# EAGLE design AFM_QFM_Piezo_controller (EAGLE 9.6.2)
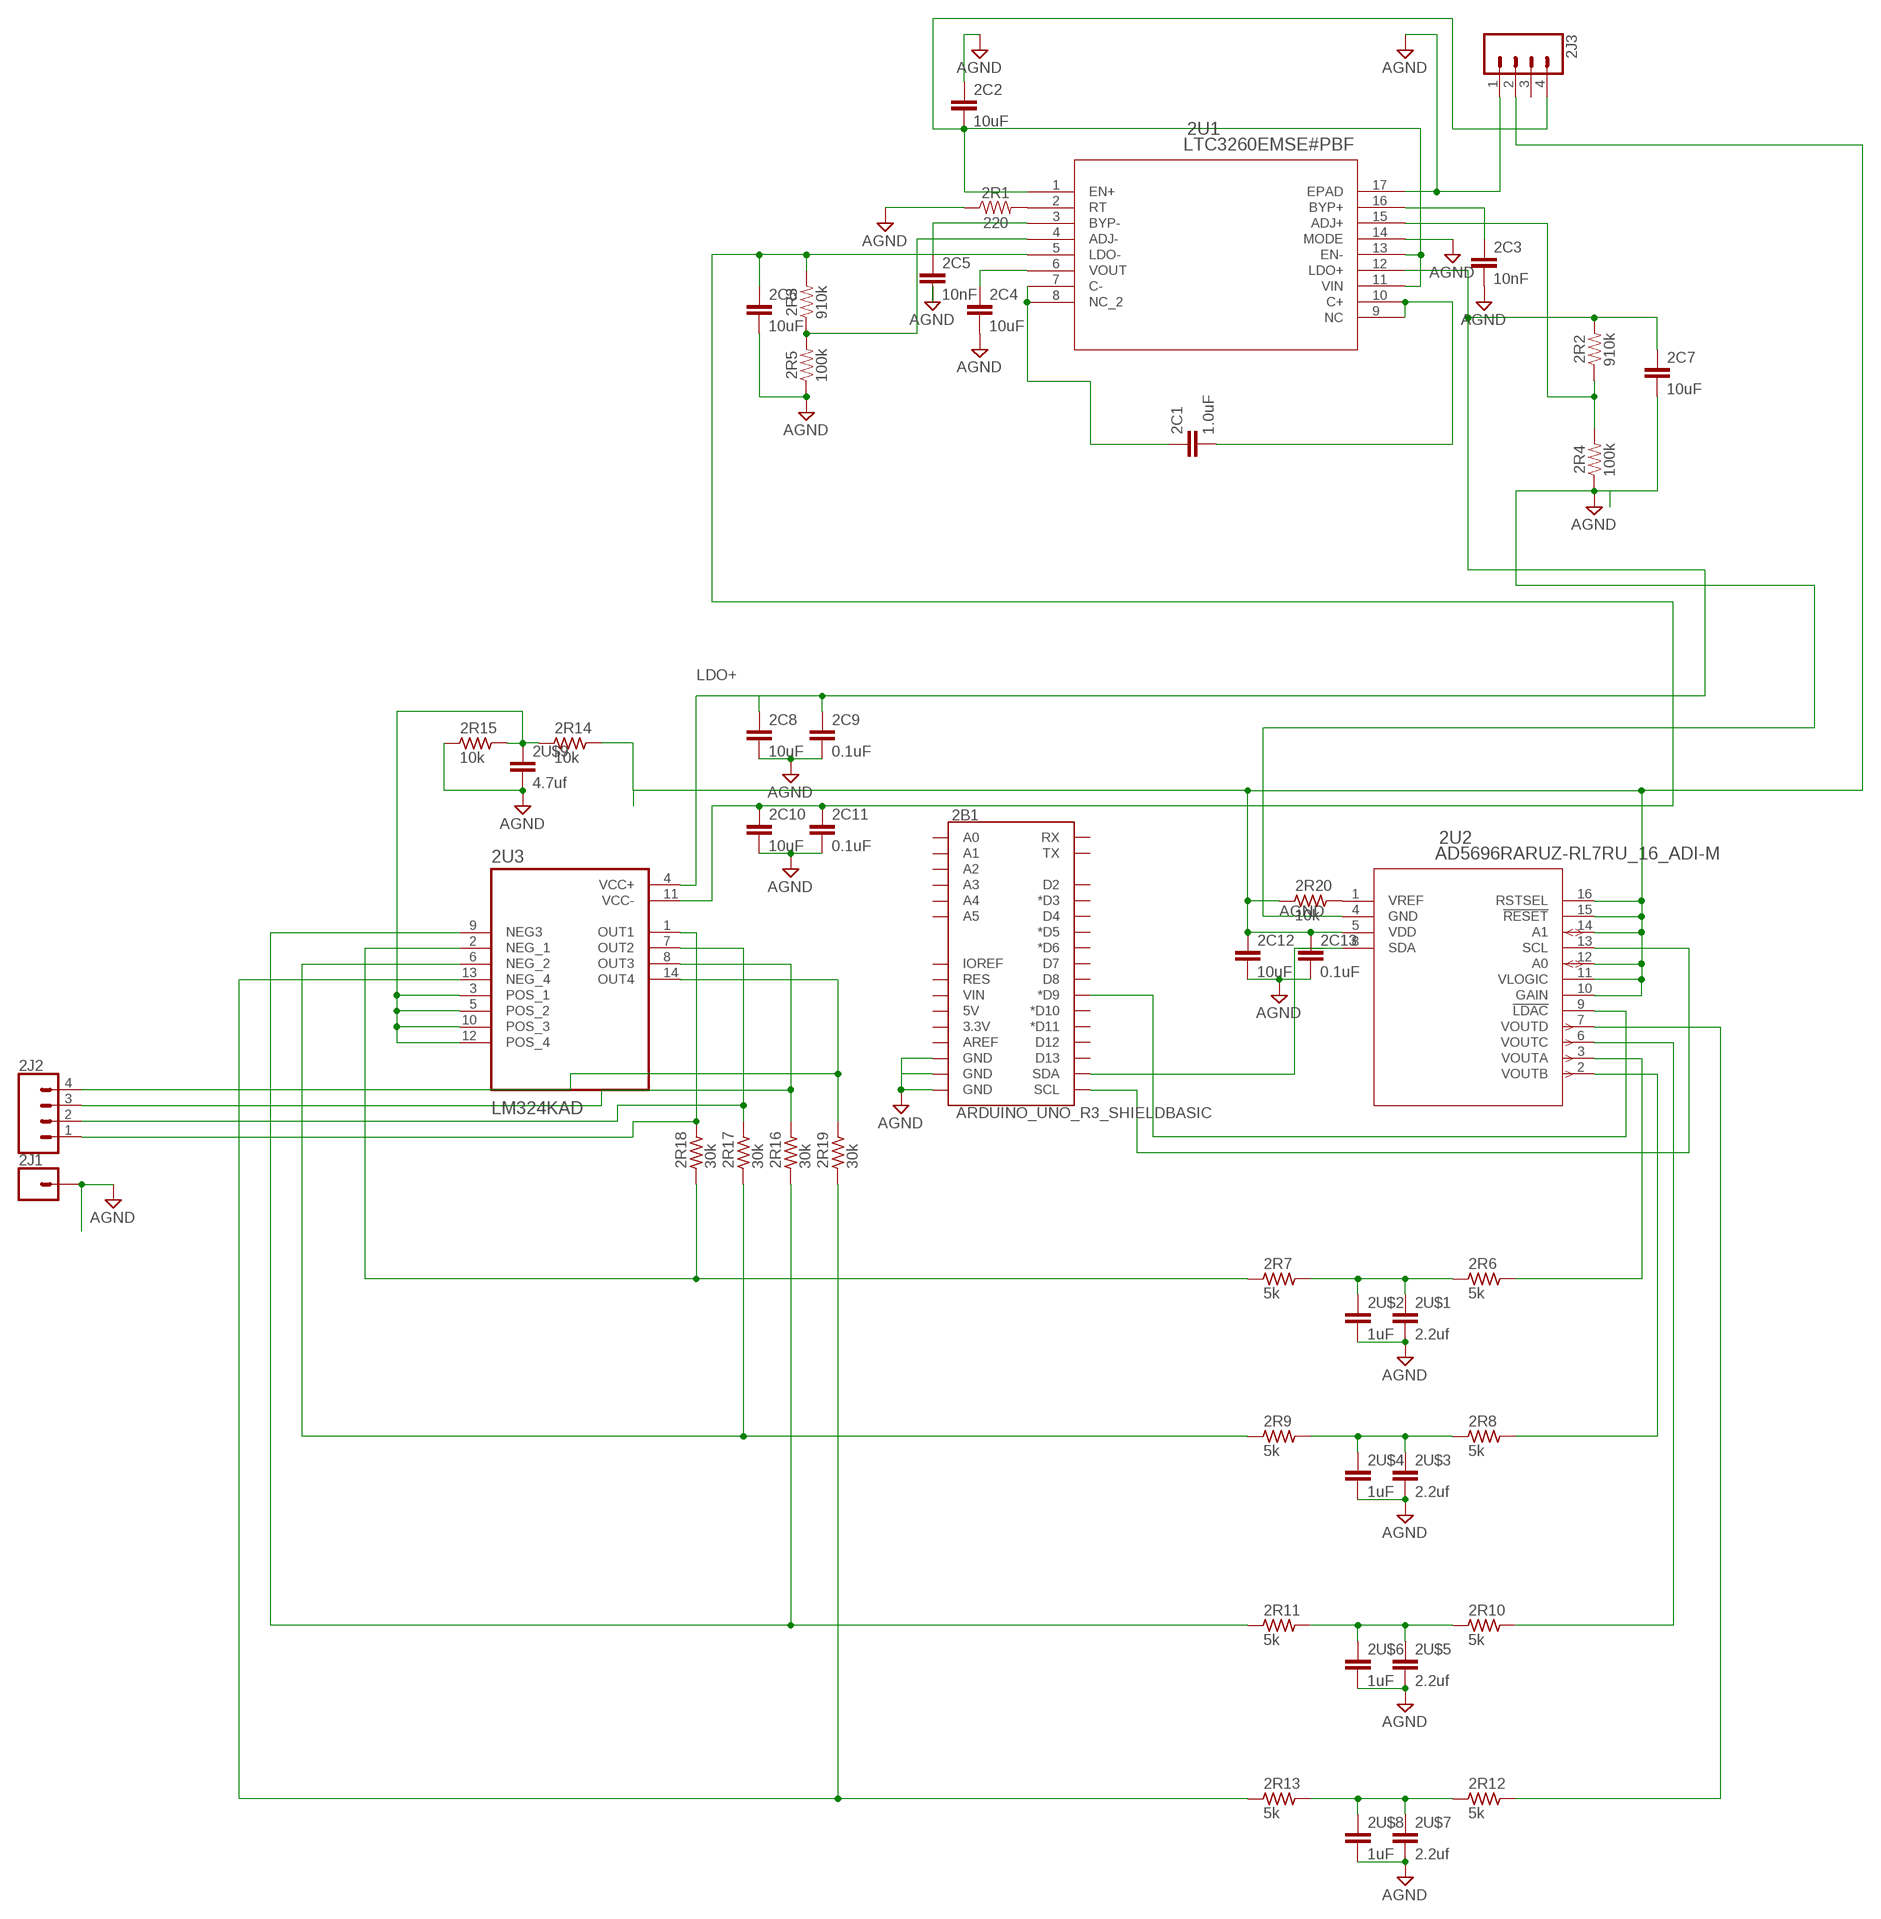
[diagram p0: schematic, sheet 1]

## Parts
2B1  ARDUINO_UNO_R3_SHIELDBASIC  [UNO_R3_SHIELD]
2C1  1.0uF  1.0UF-0805-25V-(+80/-20%)  [0805]
2C2  10uF  10UF-0805-25V-10%  [0805]
2C3  10nF  10NF-0603-50V-10%  [0603]
2C4  10uF  10UF-0805-25V-10%  [0805]
2C5  10nF  10NF-0603-50V-10%  [0603]
2C6  10uF  10UF-0805-25V-10%  [0805]
2C7  10uF  10UF-0805-25V-10%  [0805]
2C8  10uF  10UF-0805-10V-10%  [0805]
2C9  0.1uF  C  [C0805]
2C10  10uF  10UF-0805-10V-10%  [0805]
2C11  0.1uF  C  [C0805]
2C12  10uF  10UF-0805-10V-10%  [0805]
2C13  0.1uF  C  [C0805]
2J1  CONN_01PTH_LONGPAD  [1X01_LONGPAD]
2J2  CONN_04LONGPADS  [1X04_LONGPADS]
2J3  CONN_04LONGPADS  [1X04_LONGPADS]
2R1  220  220OHM-0603-1/10W-1%  [0603]
2R2  910k  100KOHM-0603-1/10W-1%  [0603]
2R3  910k  100KOHM-0603-1/10W-1%  [0603]
2R4  100k  300KOHM-0603-1/10W-1%  [0603]
2R5  100k  300KOHM-0603-1/10W-1%  [0603]
2R6  5k  RC-MASTER-SMD_R_0603MP  [RC-MASTER-SMD_R0603MP]
2R7  5k  RC-MASTER-SMD_R_0603MP  [RC-MASTER-SMD_R0603MP]
2R8  5k  RC-MASTER-SMD_R_0603MP  [RC-MASTER-SMD_R0603MP]
2R9  5k  RC-MASTER-SMD_R_0603MP  [RC-MASTER-SMD_R0603MP]
2R10  5k  RC-MASTER-SMD_R_0603MP  [RC-MASTER-SMD_R0603MP]
2R11  5k  RC-MASTER-SMD_R_0603MP  [RC-MASTER-SMD_R0603MP]
2R12  5k  RC-MASTER-SMD_R_0603MP  [RC-MASTER-SMD_R0603MP]
2R13  5k  RC-MASTER-SMD_R_0603MP  [RC-MASTER-SMD_R0603MP]
2R14  10k  RC-MASTER-SMD_R_0603MP  [RC-MASTER-SMD_R0603MP]
2R15  10k  RC-MASTER-SMD_R_0603MP  [RC-MASTER-SMD_R0603MP]
2R16  30k  RC-MASTER-SMD_R_0603MP  [RC-MASTER-SMD_R0603MP]
2R17  30k  RC-MASTER-SMD_R_0603MP  [RC-MASTER-SMD_R0603MP]
2R18  30k  RC-MASTER-SMD_R_0603MP  [RC-MASTER-SMD_R0603MP]
2R19  30k  RC-MASTER-SMD_R_0603MP  [RC-MASTER-SMD_R0603MP]
2R20  10k  RC-MASTER-SMD_R_0603MP  [RC-MASTER-SMD_R0603MP]
2U1  LTC3260EMSE#PBF  [MSOP-16_MSE]
2U2  AD5696RARUZ-RL7RU_16_ADI-M  [RU_16_ADI-M]
2U3  LM324KAD  [SOIC127P600X175-14N]
2U$1  2.2uf  CAPACITOR_0603_M  [RESC0603_M]
2U$2  1uF  CAPACITOR_0603_M  [RESC0603_M]
2U$3  2.2uf  CAPACITOR_0603_M  [RESC0603_M]
2U$4  1uF  CAPACITOR_0603_M  [RESC0603_M]
2U$5  2.2uf  CAPACITOR_0603_M  [RESC0603_M]
2U$6  1uF  CAPACITOR_0603_M  [RESC0603_M]
2U$7  2.2uf  CAPACITOR_0603_M  [RESC0603_M]
2U$8  1uF  CAPACITOR_0603_M  [RESC0603_M]
2U$9  4.7uf  CAPACITOR_0603_M  [RESC0603_M]

## Nets
AGND: 2B1.GND@0(GND) 2B1.GND@1(GND) 2B1.GND@2(GND) 2C2.1 2C3.2 2C4.2 2C5.2 2C6.2 2C7.2 2C8.2 2C9.2 2C10.2 2C11.2 2C12.2 2C13.2 2J1.1 2J3.1 2R1.1 2R4.1 2R5.1 2R15.1 2U1.14(MODE) 2U1.17(EPAD) 2U2.4(GND) 2U$1.2 2U$2.2 2U$3.2 2U$4.2 2U$5.2 2U$6.2 2U$7.2 2U$8.2 2U$9.2
LDAC: 2B1.D9(*D9) 2U2.9(!LDAC)
LDO+: 2C7.1 2C8.1 2C9.1 2R2.2 2U1.12(LDO+) 2U3.4(VCC+)
LDO-: 2C6.1 2C10.1 2C11.1 2R3.2 2U1.5(LDO-) 2U3.11(VCC-)
N$1: 2C5.1 2U1.3(BYP-)
N$2: 2R1.2 2U1.2(RT)
N$3: 2C1.1 2U1.7(C-) 2U1.8(NC_2)
N$4: 2C1.2 2U1.9(NC) 2U1.10(C+)
N$6: 2C3.1 2U1.16(BYP+)
N$7: 2C4.1 2U1.6(VOUT)
N$8: 2R3.1 2R5.2 2U1.4(ADJ-)
N$9: 2R6.1 2R7.2 2U$1.1 2U$2.1
N$12: 2R2.1 2R4.2 2U1.15(ADJ+)
N$16: 2R7.1 2R18.1 2U3.2(NEG_1)
N$18: 2R8.1 2R9.2 2U$3.1 2U$4.1
N$19: 2R9.1 2R17.1 2U3.6(NEG_2)
N$21: 2R10.1 2R11.2 2U$5.1 2U$6.1
N$22: 2R11.1 2R16.1 2U3.9(NEG3)
N$24: 2R12.1 2R13.2 2U$7.1 2U$8.1
N$25: 2R13.1 2R19.1 2U3.13(NEG_4)
N$35: 2R20.2 2U2.1(VREF)
P_OUT1: 2J2.1 2R18.2 2U3.1(OUT1)
P_OUT2: 2J2.2 2R17.2 2U3.7(OUT2)
P_OUT3: 2J2.3 2R16.2 2U3.8(OUT3)
P_OUT4: 2J2.4 2R19.2 2U3.14(OUT4)
SCL: 2B1.SCL 2U2.13(SCL)
SDA: 2B1.SDA 2U2.8(SDA)
V15+: 2C2.2 2J3.4 2U1.1(EN+) 2U1.11(VIN) 2U1.13(EN-)
V_REF: 2R14.1 2R15.2 2U3.3(POS_1) 2U3.5(POS_2) 2U3.10(POS_3) 2U3.12(POS_4) 2U$9.1
VDD: 2C12.1 2C13.1 2J3.2 2R14.2 2R20.1 2U2.5(VDD) 2U2.10(GAIN) 2U2.11(VLOGIC) 2U2.12(A0) 2U2.14(A1) 2U2.15(!RESET) 2U2.16(RSTSEL)
VOUTA: 2R6.2 2U2.3(VOUTA)
VOUTB: 2R8.2 2U2.2(VOUTB)
VOUTC: 2R10.2 2U2.6(VOUTC)
VOUTD: 2R12.2 2U2.7(VOUTD)
Unconnected: 2B1.3.3V 2B1.5V 2B1.A0 2B1.A1 2B1.A2 2B1.A3 2B1.A4 2B1.A5 2B1.AREF 2B1.D2 2B1.D3(*D3) 2B1.D4 2B1.D5(*D5) 2B1.D6(*D6) 2B1.D7 2B1.D8 2B1.D10(*D10) 2B1.D11(*D11) 2B1.D12 2B1.D13 2B1.IOREF 2B1.RES 2B1.RX 2B1.TX 2B1.VIN 2J3.3

## Library data of the parts
2B1 = SparkFun-Boards:ARDUINO_UNO_R3_SHIELD: Arduino R3 Shield Footprint Shield form compatible with the Arduino Uno R3. SparkFun Products: MG2639 Cellular Shield <https://www.sparkfun.com/products/13120> MIDI Shield <https://www.sparkfun.com/products/12898> R3 Stackable Headers Kit <https://www.sparkfun.com/products/11417>
2C1 = SparkFun-Capacitors:1.0UF: 1µF ceramic capacitors A capacitor is a passive two-terminal electrical component used to store electrical energy temporarily in an electric field.; PROD_ID: CAP-11625
2C2 2C4 2C6 2C7 = SparkFun-Capacitors:10UF: 10.0µF ceramic capacitors A capacitor is a passive two-terminal electrical component used to store electrical energy temporarily in an electric field.; PROD_ID: CAP-14259
2C3 2C5 = SparkFun-Capacitors:10NF: 0.01uF/10nF/10,000pF ceramic capacitors A capacitor is a passive two-terminal electrical component used to store electrical energy temporarily in an electric field. CAP-09321; PROD_ID: CAP-00867
2C8 2C10 2C12 = SparkFun-Capacitors:10UF: 10.0µF ceramic capacitors A capacitor is a passive two-terminal electrical component used to store electrical energy temporarily in an electric field.; PROD_ID: CAP-11330
2C9 2C11 2C13 = eagle-ltspice:C: CAPACITOR, European symbol; SPICEMODEL: NONE; SPICEPREFIX: C
2J1 = SparkFun-Connectors:CONN_01: Single connection point. Often used as Generic Header-pin footprint for 0.1 inch spaced/style header connections On any of the 0.1 inch spaced packages, you can populate with these: Break Away Headers - Straight <https://www.sparkfun.com/products/116> (PRT-00116) Break Away Male Headers - Right Angle <https://www.sparkfun.com/products/553> (PRT-00553) Female Headers <https://www.sparkfun.com/products/115> (PRT-00115) Break Away Headers - Machine Pin <https://www.sparkfun.com/products/117> (PRT-00117) Break Away Female Headers - Swiss Machine Pin <https://www.sparkfun.com/products/743> (PRT-00743) This device is also useful as a general connection point to wire up your design to another part of your project. Our various solder wires solder well into these plated through hole pads. Hook-Up Wire - Assortment (Stranded, 22 AWG) <https://www.sparkfun.com/products/11375> (PRT-11375) Hook-Up Wire - Assortment (Solid Core, 22 AWG) <https://www.sparkfun.com/products/11367> (PRT-11367) View the entire wire category on our website here <https://www.sparkfun.com/categories/141> Special notes: SMTSO-256-ET is a "flush mount" nut for a 4-40 screw. We mostly use this on specialty testbeds; it is a nice way to connect hardware to your PCB at an adjustable hieght. Also note, the SNAP packages are for using a snappable style connector. We sell a baggie of snaps and they are also used on two LilyPad designs: Snap Assortment - 30 pack (male and female) <https://www.sparkfun.com/products/11347> (DEV-11347) LilyPad Arduino SimpleSnap <https://www.sparkfun.com/products/10941> (DEV-10941) LilyPad SimpleSnap Protoboard <https://www.sparkfun.com/products/10940> (DEV-10940)
2J2 2J3 = SparkFun-Connectors:CONN_04: Multi connection point. Often used as Generic Header-pin footprint for 0.1 inch spaced/style header connections On any of the 0.1 inch spaced packages, you can populate with these: Break Away Headers - Straight <https://www.sparkfun.com/products/116> (PRT-00116) Break Away Male Headers - Right Angle <https://www.sparkfun.com/products/553> (PRT-00553) Female Headers <https://www.sparkfun.com/products/115> (PRT-00115) Break Away Headers - Machine Pin <https://www.sparkfun.com/products/117> (PRT-00117) Break Away Female Headers - Swiss Machine Pin <https://www.sparkfun.com/products/743> (PRT-00743) For SCREWTERMINALS and SPRING TERMINALS visit here: Screw Terimnals on SparkFun.com <https://www.sparkfun.com/search/results?term=Screw+Terminals> (5mm/3.5mm/2.54mm spacing) This device is also useful as a general connection point to wire up your design to another part of your project. Our various solder wires solder well into these plated through hole pads. Hook-Up Wire - Assortment (Stranded, 22 AWG) <https://www.sparkfun.com/products/11375> (PRT-11375) Hook-Up Wire - Assortment (Solid Core, 22 AWG) <https://www.sparkfun.com/products/11367> (PRT-11367) View the entire wire category on our website here <https://www.sparkfun.com/categories/141> Special notes: Molex polarized connector foot print use with SKU : PRT-08231 with associated crimp pins and housings. 1MM SMD Version SKU: PRT-10208; PROD_ID: CONN-09696
2R1 = SparkFun-Resistors:220OHM: 220Ω resistor A resistor is a passive two-terminal electrical component that implements electrical resistance as a circuit element. Resistors act to reduce current flow, and, at the same time, act to lower voltage levels within circuits. - Wikipedia; PROD_ID: RES-07861
2R2 2R3 = SparkFun-Resistors:100KOHM: 100kΩ resistor A resistor is a passive two-terminal electrical component that implements electrical resistance as a circuit element. Resistors act to reduce current flow, and, at the same time, act to lower voltage levels within circuits. - Wikipedia; PROD_ID: RES-07828; VALUE: 100k
2R4 2R5 = SparkFun-Resistors:300KOHM: 300kΩ resistor A resistor is a passive two-terminal electrical component that implements electrical resistance as a circuit element. Resistors act to reduce current flow, and, at the same time, act to lower voltage levels within circuits. - Wikipedia; PROD_ID: RES-10809; VALUE: 300k
2R6-2R20 = 52101-101-REV-A_v16:RC-MASTER-SMD_R_: RESISTOR
2U1 = LTC3260EMSE_PBF (1):LTC3260EMSE#PBF: Check availability <https://pricing.snapeda.com/parts/LTC3260EMSE%23PBF/Analog%20Devices/view-part?ref=eda>; AVAILABILITY: In Stock; CHECK_PRICES: https://www.snapeda.com/parts/LTC3260EMSE%23PBF/Analog+Devices/view-part/?ref=eda; DESCRIPTION: Low Noise Dual Supply Inverting Charge Pump; MF: Analog Devices; MP: LTC3260EMSE#PBF; PACKAGE: MSOP -16 Analog Devices; PRICE: None; PURCHASE-URL: https://www.snapeda.com/api/url_track_click_mouser/?unipart_id=4339513&manufacturer=Analog Devices&part_name=LTC3260EMSE#PBF&search_term=None; SNAPEDA_LINK: https://www.snapeda.com/parts/LTC3260EMSE%23PBF/Analog+Devices/view-part/?ref=snap
2U2 = AD5696:AD5696RARUZ-RL7; COPYRIGHT: Copyright (C) 2024 Ultra Librarian. All rights reserved.; MANUFACTURER_PART_NUMBER: AD5696RARUZ-RL7; MFR_NAME: Analog Devices Inc
2U3 = LM324KAD:LM324KAD: Check availability <https://pricing.snapeda.com/parts/LM324KAD/Texas%20Instruments/view-part?ref=eda>; AVAILABILITY: In Stock; CHECK_PRICES: https://www.snapeda.com/parts/LM324KAD/Texas+Instruments/view-part/?ref=eda; DESCRIPTION: Quad, 30-V, 1.2-MHz, 3-mV offset voltage, improved ESD (2kV) operational amplifier; MF: Texas Instruments; MP: LM324KAD; PACKAGE: SOIC-14 Texas Instruments; PRICE: None; PURCHASE-URL: https://www.snapeda.com/api/url_track_click_mouser/?unipart_id=497506&manufacturer=Texas Instruments&part_name=LM324KAD&search_term=lm324; SNAPEDA_LINK: https://www.snapeda.com/parts/LM324KAD/Texas+Instruments/view-part/?ref=snap
2U$1-2U$9 = Nordic_nRF:CAPACITOR: Generic chip capacitor

## Board
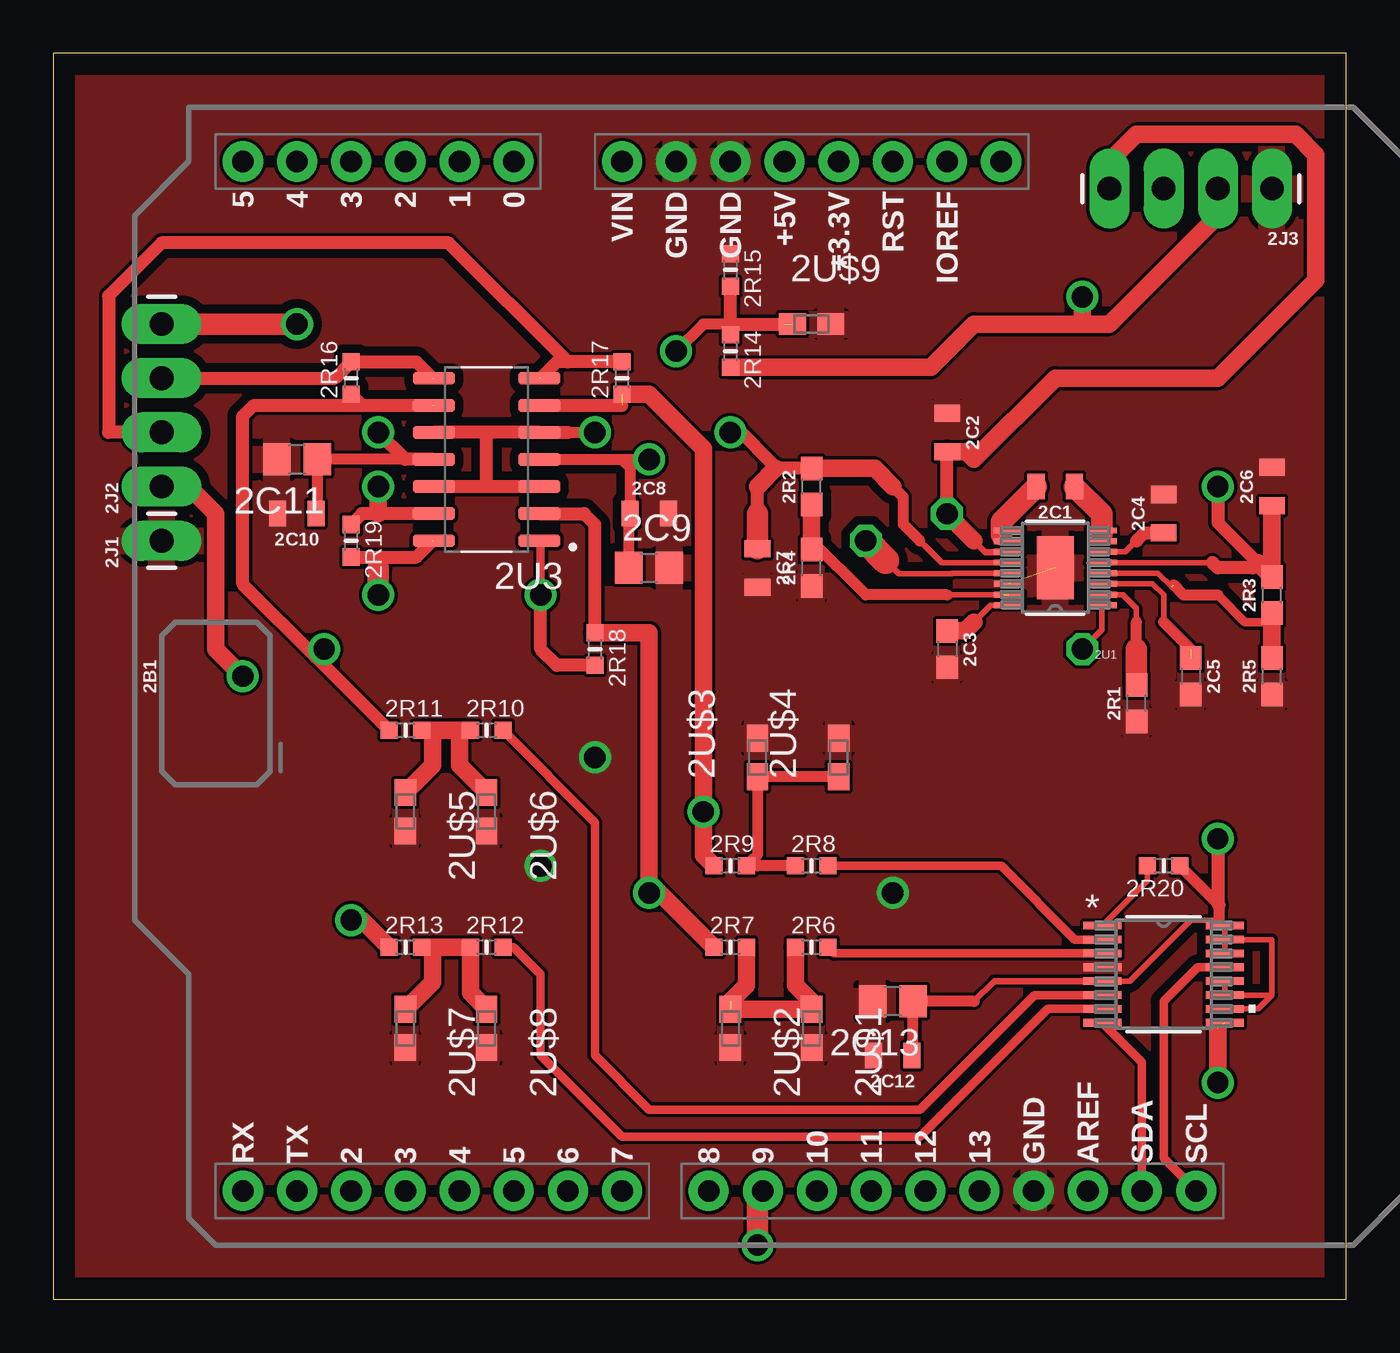
[diagram p1: board, top side]
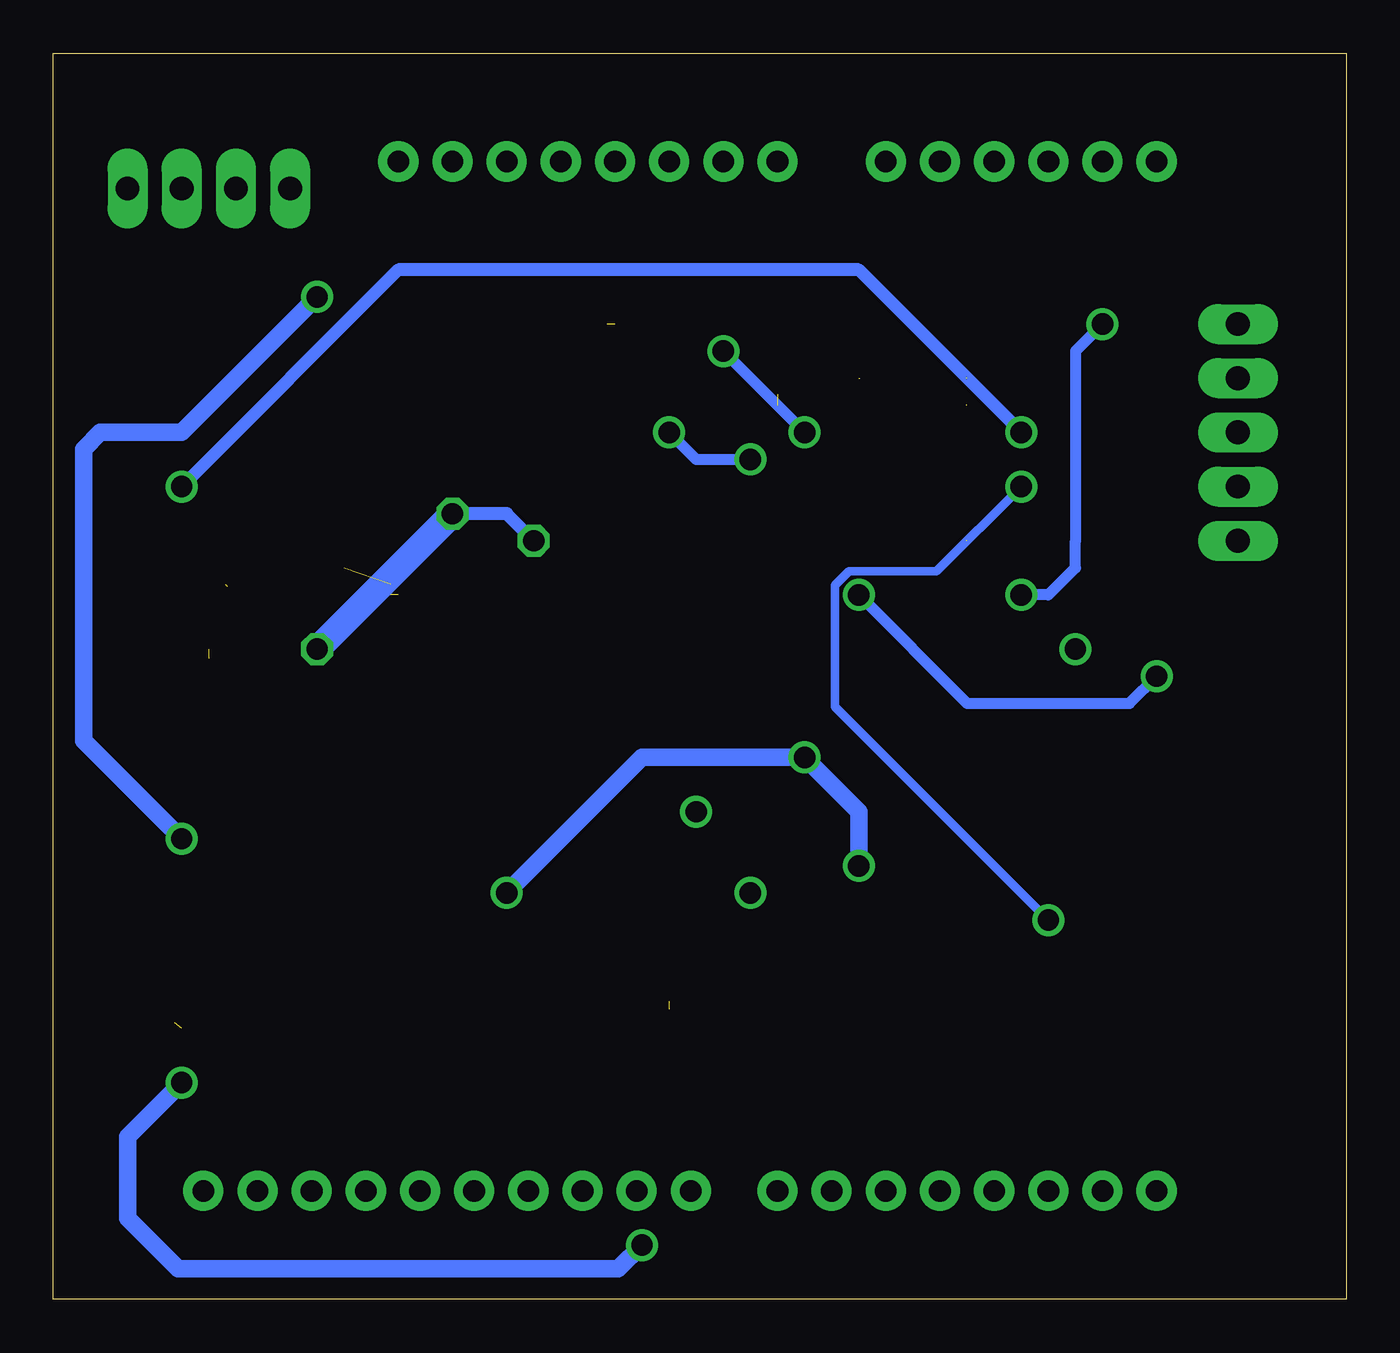
[diagram p2: board, bottom side, seen from below]

Size 60.63 x 58.41 mm. Coordinates in mm from the lower left corner, seen from the top.
Outline: 0,0 60.63,0 60.63,58.41 0,58.41 0,0
Copper layers (1*16): Top 0.035mm / dielectric 1.5mm / Bottom 0.035mm
Design rules "default": minimum track width 6mil, minimum drill 0.35mm, track to track 6mil, track to pad 6mil, pad to pad 6mil, via to via 6mil, smd to smd 6mil, copper to edge 40mil, drill to drill 6mil, minimum pad ring 10mil, minimum via ring 8mil, stop-mask expansion 4mil, vias tented up to drill 0mil, thermal gap 10mil

### Footprints (pad centres in the part's own frame; a part is rotated, then mirrored left to right if it is on the bottom)
UNO_R3_SHIELD = drill 1.016 pad 1.88: 3.3V 24.13,-2.54; 5V 24.13,0; A0 24.13,12.7; A1 24.13,15.24; A2 24.13,17.78; A3 24.13,20.32; A4 24.13,22.86; A5 24.13,25.4; AREF -24.13,-14.224; D2 -24.13,20.32; D3 -24.13,17.78; D4 -24.13,15.24; D5 -24.13,12.7; D6 -24.13,10.16; D7 -24.13,7.62; D8 -24.13,3.556; D9 -24.13,1.016; D10 -24.13,-1.524; D11 -24.13,-4.064; D12 -24.13,-6.604; D13 -24.13,-9.144; GND@0 24.13,2.54; GND@1 24.13,5.08; GND@2 -24.13,-11.684; IOREF 24.13,-7.62; NC 24.13,-10.16; RES 24.13,-5.08; RX -24.13,25.4; SCL -24.13,-19.304; SDA -24.13,-16.764; TX -24.13,22.86; VIN 24.13,7.62
0805 = smd 0.8 x 1.2: 1 -0.9,0; 2 0.9,0
0603 = smd 1.1 x 1: 1 -0.85,0; 2 0.85,0
C0805 = smd 1.3 x 1.5: 1 -0.95,0; 2 0.95,0
1X01_LONGPAD = drill 1.118 pad 1.88 long: 1 0,0
1X04_LONGPADS = drill 1.118 pad 1.88 long: 1 0,0; 2 2.54,0; 3 5.08,0; 4 7.62,0
RC-MASTER-SMD_R0603MP = smd 0.8 x 0.8: 1 -0.762,0; 2 0.762,0
MSOP-16_MSE = smd 1.397 x 0.279: 1 -2.184,1.751; 2 -2.184,1.251; 3 -2.184,0.751; 4 -2.184,0.25; 5 -2.184,-0.25; 6 -2.184,-0.751; 7 -2.184,-1.251; 8 -2.184,-1.751; 9 2.184,-1.751; 10 2.184,-1.251; 11 2.184,-0.751; 12 2.184,-0.25; 13 2.184,0.25; 14 2.184,0.751; 15 2.184,1.251; 16 2.184,1.751 | smd 1.753 x 2.946: 17 0,0
RU_16_ADI-M = smd 1.778 x 0.356: 1 -2.87,2.275; 2 -2.87,1.625; 3 -2.87,0.975; 4 -2.87,0.325; 5 -2.87,-0.325; 6 -2.87,-0.975; 7 -2.87,-1.625; 8 -2.87,-2.275; 9 2.87,-2.275; 10 2.87,-1.625; 11 2.87,-0.975; 12 2.87,-0.325; 13 2.87,0.325; 14 2.87,0.975; 15 2.87,1.625; 16 2.87,2.275
SOIC127P600X175-14N = smd 1.97 x 0.6: 1 -2.475,3.81; 2 -2.475,2.54; 3 -2.475,1.27; 4 -2.475,0; 5 -2.475,-1.27; 6 -2.475,-2.54; 7 -2.475,-3.81; 8 2.475,-3.81; 9 2.475,-2.54; 10 2.475,-1.27; 11 2.475,0; 12 2.475,1.27; 13 2.475,2.54; 14 2.475,3.81
RESC0603_M = smd 1.25 x 1: 1 -0.9,0; 2 0.9,0

### Placement (x,y rotation side)
2B1  34.29,29.21 90 top
2C1  46.99,38.1 180 top
2C2  41.91,40.64 270 top
2C3  41.91,30.48 270 top
2C4  52.07,36.83 90 top
2C5  53.34,29.21 270 top
2C6  57.15,38.1 90 top
2C7  33.02,34.29 270 top
2C8  27.94,36.83 0 top
2C9  27.94,34.29 0 top
2C10  11.43,36.83 180 top
2C11  11.43,39.37 180 top
2C12  39.37,11.43 180 top
2C13  39.37,13.97 180 top
2J1  5.08,35.56 90 top
2J2  5.08,38.1 90 top
2J3  57.15,52.07 180 top
2R1  50.8,27.94 90 top
2R2  35.56,38.1 90 top
2R3  57.15,33.02 90 top
2R4  35.56,34.29 90 top
2R5  57.15,29.21 90 top
2R6  35.56,16.51 0 top
2R7  31.75,16.51 0 top
2R8  35.56,20.32 0 top
2R9  31.75,20.32 0 top
2R10  20.32,26.67 0 top
2R11  16.51,26.67 0 top
2R12  20.32,16.51 0 top
2R13  16.51,16.51 0 top
2R14  31.75,44.45 270 top
2R15  31.75,48.26 270 top
2R16  13.97,43.18 90 top
2R17  26.67,43.18 90 top
2R18  25.4,30.48 270 top
2R19  13.97,35.56 270 top
2R20  52.07,20.32 180 top
2U1  46.99,34.29 180 top
2U2  52.07,15.24 0 top
2U3  20.32,39.37 180 top
2U$1  35.56,12.7 270 top
2U$2  31.75,12.7 270 top
2U$3  33.02,25.4 90 top
2U$4  36.83,25.4 90 top
2U$5  16.51,22.86 270 top
2U$6  20.32,22.86 270 top
2U$7  16.51,12.7 270 top
2U$8  20.32,12.7 270 top
2U$9  35.56,45.72 0 top

### Tracks (layer width: path | path; a pad name or v marks a point on that pad's centre or on a via)
AGND  (via drill 1)  (1 unrouted)
  Bottom 0.813: v22.86,20.32 22.86,22.86 v25.4,25.4 33.02,25.4 v39.37,19.05
  pour Top (isolate 0.406, rank 6): 0,58.42 60.96,58.42 60.96,0 0,0
  pour Top: 60.96,58.42 60.96,0 0,0 0,58.42
  pour Top: 60.96,58.42 60.96,0 0,0 0,58.42
  pour Top (isolate 0.254): 60.96,58.42 60.96,0 0,0 0,58.42
  pour Top (isolate 0.406): 60.96,58.42 60.96,0 0,0 0,58.42
LDAC  (via drill 1)  (1 unrouted)
  Top 0.813: v54.61,10.16 54.61,12.7
  Top 1.016: v33.02,2.54 33.02,4.83 2B1.D9
  Bottom 0.813: v54.61,10.16 57.15,7.62 57.15,3.81 54.76,1.42 34.14,1.42 v33.02,2.54
LDO+  (via drill 1)
  Top 0.254: 2U1.12 41.66,34.54 40.53,35.67
  Top 0.508: 39.37,38.1 39.85,37.62 39.85,36.35 40.53,35.67 40.64,35.56 | 2U3.4 26.67,39.37 | 26.67,39.37 v27.94,39.37 | v31.75,40.64 32,40.89 | 26.67,39.37 27.04,39 2C8.1 26.99,36.78 2C9.1
  Top 0.61: 32,40.89 33.87,39.03 33.87,38.95 2R2.2 | 33.02,36.83 33.02,38.1
  Top 0.813: 39.37,38.1 38.52,38.95 2R2.2 | 33.87,38.95 33.02,38.1
  Top 1.016: 2C7.1 33.02,36.83
  Bottom 0.508: v31.75,40.64 30.48,39.37 v27.94,39.37
LDO-  (via drill 1)
  Top 0.152: 2U1.5 48.51,34.54
  Top 0.254: 54.36,34.54 2U1.5
  Top 0.508: 16.51,39.37 2C11.1 12.38,36.88 2C10.1
  Top 0.61: 56.48,34.54 56.23,34.29 54.61,34.29 54.36,34.54 | 2U3.11 16.51,39.37 v15.24,40.64 | v54.61,38.1 54.61,36.41 2R3.2
  Top 0.813: 56.48,34.54 2R3.2 2C6.1
  Bottom 0.61: v15.24,40.64 22.86,48.26 44.45,48.26 v54.61,38.1
N$1  (1 unrouted)
  Top 0.254: 2U1.3 51.55,33.54 52.07,33.02 52.07,31.75
  Top 0.508: 52.07,31.75 53.34,30.48
N$2
  Top 0.254: 50.8,31.75 50.8,32.39 50.15,33.04 2U1.2
  Top 0.508: 50.8,30.48 50.8,31.75
  Top 1.016: 2R1.2 50.8,30.48
N$3
  Top 0.254: 2U1.7 2U1.8
  Top 1.016: 2C1.1 49.17,36.82 2U1.8 49.17,35.84
N$4
  Top 0.254: 2U1.9 44.6,35.84 | 44.6,35.84 44.45,35.84 | 2U1.10 44.6,35.74 44.6,35.84
  Top 1.016: 2C1.2 44.45,36.46 44.45,35.84
N$6
  Top 0.254: 2U1.16 43.97,32.54 43.18,31.75
  Top 0.813: 43.18,31.75 42.76,31.33 2C3.1
N$7
  Top 0.254: 2U1.6 50.28,35.04 50.8,35.56
  Top 0.61: 50.8,35.56 51.17,35.93 2C4.1
N$8  (1 unrouted)
  Top 0.254: 2U1.4 51.8,34.04 52.45,33.4
  Top 0.406: 54.61,33.02 55.88,31.75 56.73,31.75 2R3.1
  Top 0.508: 52.54,33.49 53,33.02 54.61,33.02
  Top 0.813: 2R3.1 2R5.2
N$9  (1 unrouted)
  Top 0.254: 2U$1.1 34.8,14.36 34.8,14.73
  Top 0.813: 2R6.1 34.8,14.73 35.56,13.97 35.19,13.6 2U$2.1 | 2R7.2 32.51,14.73 31.75,13.97
N$12  (1 unrouted)
  Top 0.254: 44.45,33.02 41.91,33.02
  Top 0.508: 41.91,33.02 38.1,33.02 35.56,35.56
  Top 0.813: 2R2.1 35.56,35.56 2R4.2
N$16  (via drill 1)
  Top 0.61: 2R18.1 25.4,36.32 24.89,36.83 2U3.2 | v27.94,19.05 28.19,19.3
  Top 0.813: 2R7.1 28.19,19.3 27.94,19.56 27.94,31.24 2R18.1
N$18
  Top 0.508: 32.77,20.57 33.02,20.83 2U$3.1 2U$4.1 | 32.77,20.57 2R9.2 | 2R8.1 33.02,20.32 32.77,20.57
N$19  (via drill 1)  (1 unrouted)
  Top 0.61: 2U3.6 26.67,41.91
  Top 0.813: 2R9.1 30.48,20.83 v30.48,22.86 30.48,39.88 27.94,42.42 2R17.1
N$21
  Top 0.813: 2R10.1 19.05,26.67 | 19.05,26.67 17.78,26.67 | 17.78,26.67 2R11.2 | 2U$6.1 19.05,25.03 19.05,26.67 | 2U$5.1 17.78,25.03 17.78,26.67
N$22  (via drill 1)  (1 unrouted)
  Top 0.152: v12.7,30.48 12.32,30.1
  Top 0.61: 2R16.1 14.48,41.91 | 14.48,41.91 9.4,41.91 8.89,41.4 8.89,33.53 12.32,30.1 2R11.1 | 14.48,41.91 17.78,41.91
N$24
  Top 0.254: 2R13.2 2R12.1
  Top 0.813: 2U$8.1 19.56,14.36 2R12.1 17.78,16.51 17.78,14.87 2U$7.1
N$25  (via drill 1)
  Top 0.61: 2R19.1 14.48,36.83 15.24,36.83 2U3.13
  Top 0.813: v15.24,38.1 15.24,36.83 | 2R13.1 14.48,17.78 v13.97,17.78
  Bottom 0.406: v15.24,38.1 19.21,34.13 23.32,34.13 23.97,33.48 23.97,27.78 v13.97,17.78
N$35
  Top 0.254: 2U2.1 51.31,19.62 2R20.2
P_OUT1  (via drill 1)
  Top 0.406: 2U3.1 22.86,35.49 v22.86,33.02
  Top 0.61: 2R18.2 23.62,29.72 22.86,30.48 v22.86,33.02
  Top 0.813: 2J2.1 6.35,38.1 7.62,36.83 7.62,30.48 v8.89,29.21
  Bottom 0.508: v8.89,29.21 10.16,27.94 17.78,27.94 v22.86,33.02
P_OUT2  (1 unrouted)
  Top 0.61: 2R17.2 24.13,43.94 | 24.13,43.94 23.62,43.94 22.86,43.18 | 24.13,43.94 18.54,49.53 5.08,49.53 2.59,47.04 2.59,40.64 2J2.2
P_OUT3  (1 unrouted)
  Top 0.61: 17.78,43.18 17.02,43.94 2R16.2 13.21,43.18 2J2.3
P_OUT4  (via drill 1)  (1 unrouted)
  Top 0.254: v15.24,33.02 15.24,34.8 | 2R19.2 17.02,34.8
  Top 0.61: 2R19.2 15.24,34.8 17.02,34.8 17.78,35.56
  Top 1.016: v11.43,45.72 2J2.4 | v15.24,33.02 15.24,34.29
  Bottom 0.508: v11.43,45.72 12.7,44.45 12.7,35.56 12.7,34.29 13.97,33.02 v15.24,33.02
SCL
  Top 0.406: 2U2.13 53.66,15.56 52.07,13.97 52.07,6.6 2B1.SCL
SDA
  Top 0.406: 2U2.8 51.05,11.11 2B1.SDA
V15+  (via drill 1)
  Top 0.254: 2U1.13 42.16,34.04 42.13,34.01 39.65,34.01 39.19,34.47 | 2U1.1 49.17,31.39 v48.26,30.48
  Top 0.305: 2U1.11 44.79,35.03 43.71,35.03 43.18,35.56
  Top 0.61: v41.91,36.83 2C2.2
  Top 0.813: 43.18,35.56 v41.91,36.83 | 39.19,34.47 39.02,34.63 | 2C2.2 42.81,39.74 43.18,39.37 46.99,43.18 54.61,43.18 59.21,47.78 59.21,53.66 58.26,54.61 50.8,54.61 49.53,53.34 2J3.4
  Top 1.27: 39.02,34.63 v38.1,35.56
  Bottom 0.61: v38.1,35.56 39.37,36.83 v41.91,36.83
  Bottom 1.27: v48.26,30.48 v41.91,36.83
V_REF  (via drill 1)  (1 unrouted)
  Top 0.508: 24.13,40.64 v25.4,40.64 | v29.21,44.45 30.48,45.72 31.75,45.72
  Top 0.61: 20.32,40.64 2U3.5 24.13,40.64 | 20.32,40.64 2U3.10 | 2U3.3 20.32,38.1 | 20.32,38.1 2U3.12 | 20.32,38.1 20.32,40.64 | 2R14.1 31.75,45.72 | 31.75,45.72 2R15.2 | 31.75,45.72 34.29,45.72
  Bottom 0.508: v29.21,44.45 v25.4,40.64
VDD  (via drill 1)
  Top 0.254: 2U2.5 50.48,14.91 53.34,17.78 54.67,17.78 2U2.16 2U2.15 | 57.15,14.27 2U2.11 2U2.12 | 57.15,14.27 57.15,16.86 2U2.15 | 2U2.10 56.5,13.62 57.15,14.27 | 2U2.14 2U2.15
  Top 0.305: 2U2.5 44.12,14.91 43.18,13.97
  Top 0.508: 54.67,17.78 54.67,18.48 2R20.1 | 43.18,13.97 2C13.1 40.32,11.48 2C12.1
  Top 0.61: v54.61,21.59 54.61,18.54 54.67,18.48
  Top 0.813: 2R14.2 41.15,43.69 43.18,45.72 48.26,45.72 | 48.26,45.72 49.53,45.72 54.61,50.8 2J3.2 | 48.26,45.72 v48.26,46.99
  Bottom 0.813: v48.26,46.99 54.61,40.64 58.42,40.64 59.21,39.85 59.21,26.19 v54.61,21.59
VOUTA
  Top 0.406: 2U2.3 36.62,16.21 2R6.2
VOUTB
  Top 0.406: 2U2.2 47.91,16.86 44.45,20.32 2R8.2
VOUTC
  Top 0.406: 2U2.6 46.02,14.27 40.64,8.89 27.94,8.89 25.4,11.43 25.4,22.35 2R10.2
VOUTD
  Top 0.406: 2U2.7 46.63,13.62 40.64,7.62 26.67,7.62 22.86,11.43 22.86,15.24 21.59,16.51 2R12.2